# Altium schematic sheet LPCB235 - G210 IF AND MUX.SchDoc
size A3; Address1: Factory 10; Address2: 9-13 Dingley Avenue, Dandeong, VICTORIA 3175, AUSTRALIA; DocumentNumber: 11; Revision: 1; SheetNumber: 11; SheetTotal: 37; Lockie__PCB_SUB_ASSEMBLY: G210X Interface; Lockie__PCB_ASSEMBLY: FCU PCB; Lockie__LDL: LPCB235; Lockie__PCB_DESCRIPTION: Flight Control Unit
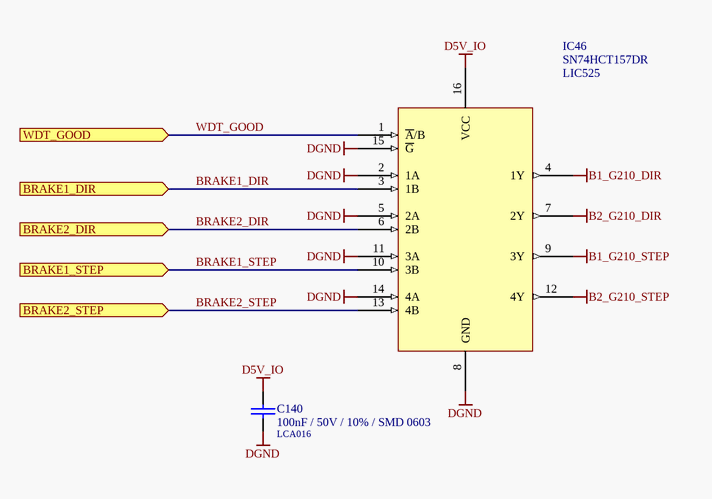
[diagram p0: LPCB235 - G210 IF AND MUX.SchDoc]

## Parts
C140  100nF / 50V / 10% / SMD 0603  LDL_NUMBER: LCA016  [LFP011__CC1608-0603-IPC7351_B]
IC46  SN74HCT157DR  LDL_NUMBER: LIC525  [LFP079__SOP16]

## Ports
BRAKE1_DIR (in), BRAKE1_STEP (in), BRAKE2_DIR (in), BRAKE2_STEP (in), WDT_GOOD (in)

## Nets
B1_G210_DIR: IC46.4(1Y)
B1_G210_STEP: IC46.9(3Y)
B2_G210_DIR: IC46.7(2Y)
B2_G210_STEP: IC46.12(4Y)
D5V_IO: C140.1 IC46.16(VCC)
DGND: C140.2 IC46.2(1A) IC46.5(2A) IC46.8(GND) IC46.11(3A) IC46.14(4A) IC46.15(~{G})
BRAKE1_DIR: IC46.3(1B) ; port BRAKE1_DIR
BRAKE1_STEP: IC46.10(3B) ; port BRAKE1_STEP
BRAKE2_DIR: IC46.6(2B) ; port BRAKE2_DIR
BRAKE2_STEP: IC46.13(4B) ; port BRAKE2_STEP
WDT_GOOD: IC46.1(~{A}/B) ; port WDT_GOOD

## Notes on the sheet
- PCB COMPONENT DESCRIPTION
- LDL NUMBER
- Assembly Details
- Size
- Drawing File Name
- Revision
- http://rloop.org
- Scale
- A3
- Sheet Details
- N.T.S
- Sheet:
- Of:

## Library data of the parts
C140 = 100nF / 50V / 10% / SMD 0603: Capacitor, Ceramic Chip, 100nF (0.1uF), 50V, 5%, SMD 0603 [LCA016]; Value: 100n; FMEDA__OPERATING__VOLTAGE_MIN: 0; FMEDA__OPERATING__VOLTAGE_MAX: 3.3; FMEDA__OPERATING__TEMP_MIN: -20; FMEDA__OPERATING__TEMP_TYP: 27; FMEDA__OPERATING__TEMP_MAX: 50; FMEDA__CHANNEL: COM; FMEDA__FUNCTION_IN_SYSTEM: *; FMEDA__OPERATING__VOLTAGE_TYP: 3.3
IC46 = SN74HCT157DR: IC, Multiplexer Select 2-1 [LIC525]; FMEDA__CHANNEL: COM; FMEDA__FUNCTION_IN_SYSTEM: *